# Altium project ESP32_WROOM_MOTOR_V11.PrjPCB
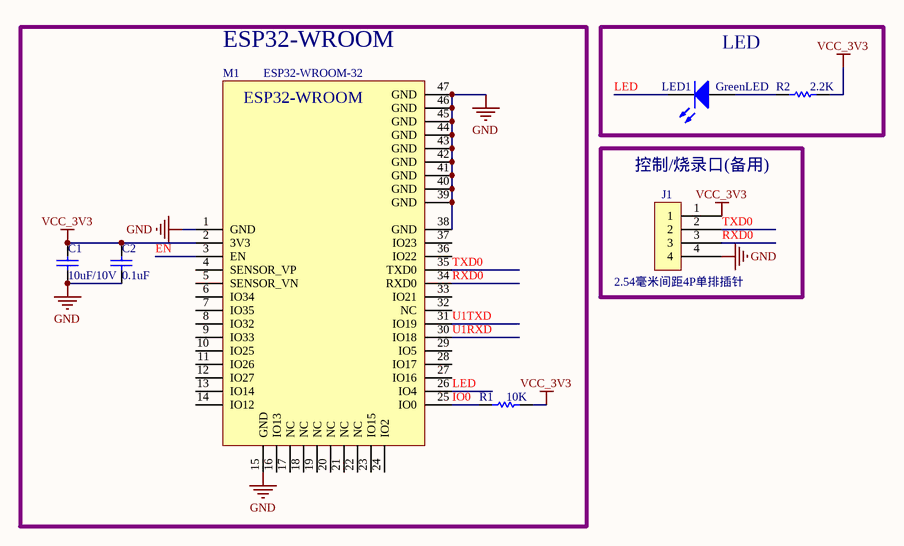
[diagram p0: 0.ESP32_WROOM.SchDoc]
5 sheets, 142 parts. Net scope: global (net labels, ports and power ports of the same name join across sheets).
Board file: ESP32_WROOM_MOTOR_V11.PcbDoc
Sheets:
  0.ESP32_WROOM.SchDoc
  1.USB-TO-UART.SchDoc
  2.POWER.SchDoc
  3.MOTOR.SchDoc
  4.POWER_48_TO_12.SchDoc

## Sheet 0.ESP32_WROOM.SchDoc
size A4; PageSetup: Record=PageOptions|CenterHorizontal=True|CenterVertical=True|PrintScale=0.50|XCorrection=1.00|YCorrection=1.00|PrintKind=1|BorderSize=5000000|LeftOffset=0|BottomOffset=0|Orientation=2|PaperLength=1000|PaperWidth=1000|Scale=100|PaperSource=7|PrintQuality=-4|MediaType=1|DitherType=10|PaperKind=A4|PrintScaleMode=1

### Parts
C1  10uF/10V  [0402]
C2  0.1uF  [0402]
J1  2.54毫米间距4P单排插针  [SIP4_2.54mm]
LED1  GreenLED  [LED0402]
M1  ESP32-WROOM-32  [ESP32_WROOM-32]
R1  10K  [0402]
R2  2.2K  [0402]

### Blocks framed on the sheet
ESP32-WROOM: C1 C2 M1 R1
LED: LED1 R2
控制/烧录口(备用): J1

### Nets
GND: C1.1 C2.1 J1.4 M1.1(GND) M1.15(GND) M1.38(GND) M1.39(GND) M1.40(GND) M1.41(GND) M1.42(GND) M1.43(GND) M1.44(GND) M1.45(GND) M1.46(GND) M1.47(GND)
VCC_3V3: C1.2 C2.2 J1.1 M1.2(3V3) R1.2 R2.2
EN: M1.3(EN)
IO0: M1.25(IO0) R1.1
LED: LED1.2(K) M1.26(IO4)
RXD0: J1.3 M1.34(RXD0)
TXD0: J1.2 M1.35(TXD0)
U1RXD: M1.30(IO18)
U1TXD: M1.31(IO19)
NetLED1_1: LED1.1(A) R2.1

Not connected (* = marked no-connect by the designer): M1 4(SENSOR_VP) 5(SENSOR_VN) 6(IO34) 7(IO35) 8(IO32) 9(IO33) 10(IO25) 11(IO26) 12(IO27) 13(IO14) 14(IO12) 16(IO13) 17(NC) 18(NC) 19(NC) 20(NC) 21(NC) 22(NC) 23(IO15) 24(IO2) 27(IO16) 28(IO17) 29(IO5) 32(NC) 33(IO21) 36(IO22) 37(IO23)

### Notes on the sheet
- (in symbol ESP32-WROOM-32) ESP32-WROOM

### Library data of the parts
C1 C2 = Cap: Capacitor; PartNumber: CAP100NF; Published: 8-Jun-2000; LatestRevisionDate: 17-Jul-2002; LatestRevisionNote: Re-released for DXP Platform.; PackageReference: 0402; Publisher: Altium Limited
  C1: Value: 10uF/10V
  C2: Value: 0.1uF
J1 = SIP4_MIRROR: Value: 2.54毫米间距4P单排插针
LED1 = LED2: Typical RED, GREEN, YELLOW, AMBER GaAs LED; Published: 8-Jun-2000; LatestRevisionDate: 17-Jul-2002; LatestRevisionNote: Re-released for DXP Platform.; PackageVersion: Feb-2002; PackageReference: 3.2X1.6X1.1; Publisher: Altium Limited; PackageDescription: SM LED; 2 Flat Leads; Value: GreenLED
R1 R2 = Res1: Resistor; PartNumber: RES2.2K; Published: 8-Jun-2000; LatestRevisionDate: 17-Jul-2002; LatestRevisionNote: Re-released for DXP Platform.; PackageReference: 0402; Publisher: Altium Limited
  R1: Value: 10K
  R2: Value: 2.2K

## Sheet 1.USB-TO-UART.SchDoc
size A4
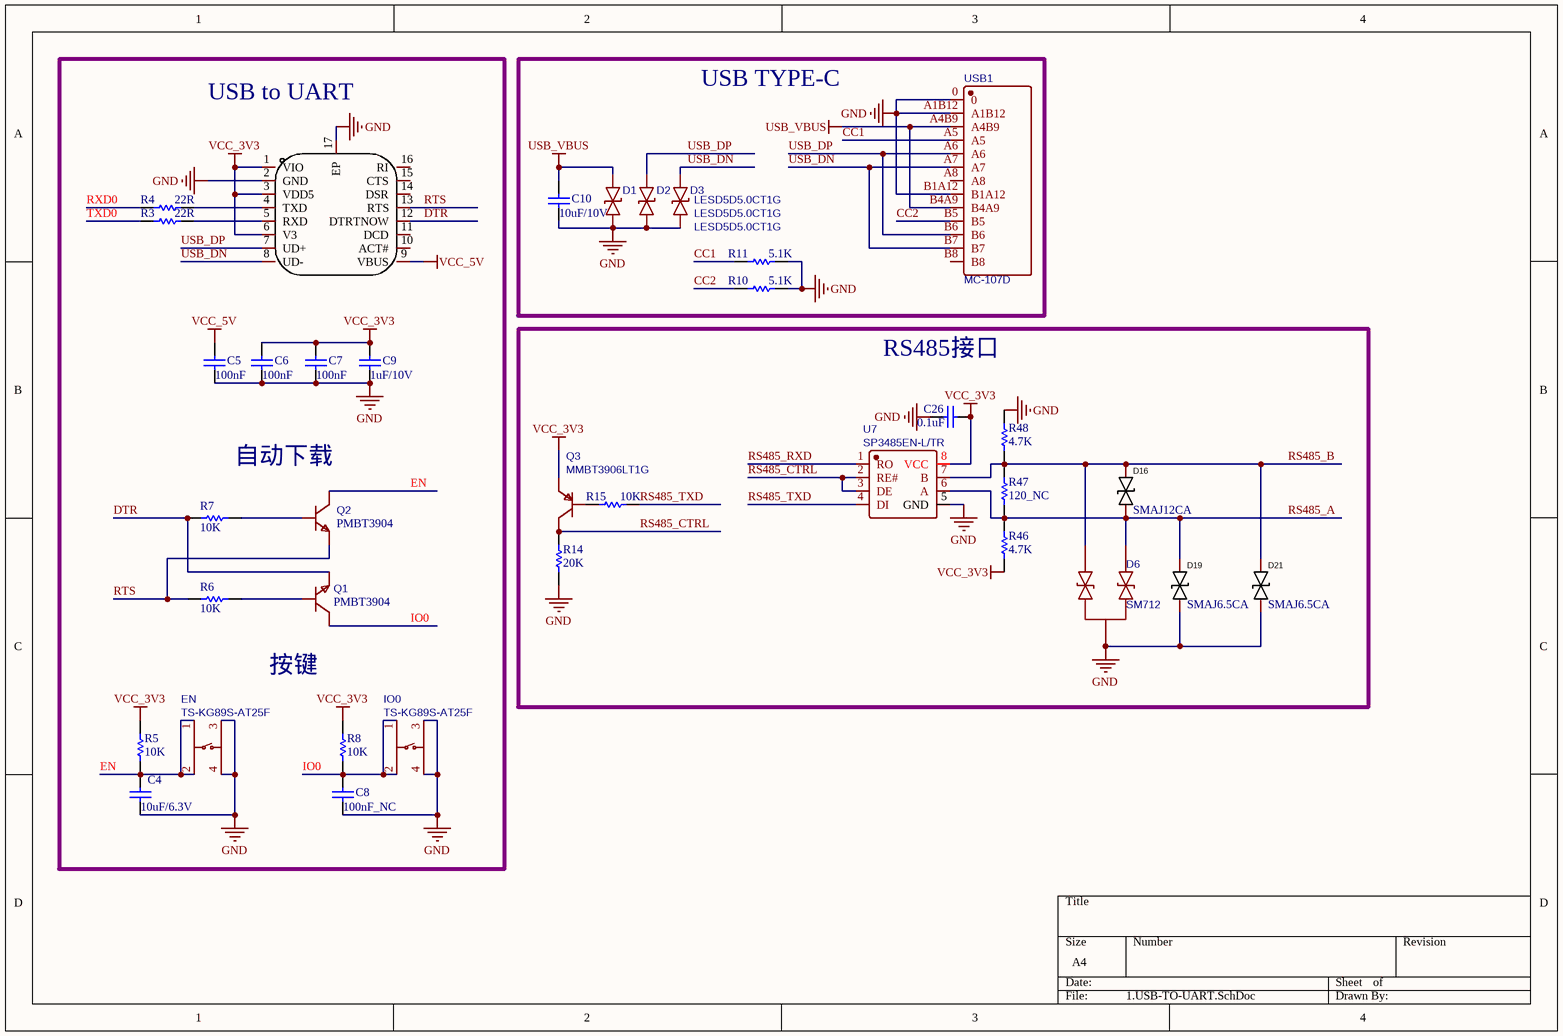
[diagram p1: 1.USB-TO-UART.SchDoc]

### Parts
C4  10uF/6.3V  [0402]
C5  100nF  [0402]
C6  100nF  [0402]
C7  100nF  [0402]
C8  100nF_NC  [0402]
C9  1uF/10V  [0402]
C10  10uF/10V  [0402]
C26  0.1uF  [0402]
D1  LESD5D5.0CT1G  [SOD-523_L1.2-W0.8-LS1.6-BI]
D2  LESD5D5.0CT1G  [SOD-523_L1.2-W0.8-LS1.6-BI]
D3  LESD5D5.0CT1G  [SOD-523_L1.2-W0.8-LS1.6-BI]
D6  SM712  [SOT-23-3_L2.9-W1.3-P1.90-LS2.4-BR]
D16  SMAJ12CA  [SMA_L4.3-W2.6-LS5.0-BI]
D19  SMAJ6.5CA  [SMA_L4.3-W2.6-LS5.0-BI]
D21  SMAJ6.5CA  [SMA_L4.3-W2.6-LS5.0-BI]
EN  TS-KG89S-AT25F  [SW-SMD_4P-L4.2-W3.3-P2.15-LS5.1]
IO0  TS-KG89S-AT25F  [SW-SMD_4P-L4.2-W3.3-P2.15-LS5.1]
Q1  PMBT3904  [SOT23]
Q2  PMBT3904  [SOT23]
Q3  MMBT3906LT1G  [SOT-23-3_L2.9-W1.3-P1.90-LS2.4-BR]
R3  22R  [0402]
R4  22R  [0402]
R5  10K  [0402]
R6  10K  [0402]
R7  10K  [0402]
R8  10K  [0402]
R10  5.1K  [0402]
R11  5.1K  [0402]
R14  20K  [0402]
R15  10K  [0402]
R46  4.7K  [0603]
R47  120_NC  [0603]
R48  4.7K  [0603]
U2  CH343P  [TQFN-16_L3.0-W3.0-P0.50-BL-EP1.7]  (value not drawn)
U7  SP3485EN-L/TR  [SOIC8]
USB1  MC-107D  [USB-C-SMD_MC-107D]

### Blocks framed on the sheet
USB TYPE-C: C10 D1-D3 R10 R11 USB1
RS485接口: C26 D6 D16 D19 D21 Q3 R14 R15 R46-R48 U7

### Nets
GND: C4.2 C5.1 C6.1 C7.1 C8.1 C9.1 C10.1 C26.1 D1.1 D2.1 D3.1 D6.3 D19.1 D21.1 EN.3 EN.4 IO0.3 IO0.4 R10.1 R11.1 R14.2 R48.2 U2.2(GND) U2.17(EP) U7.5(GND) USB1.0 USB1.A1B12 USB1.B1A12
USB_VBUS: C10.2 D1.2 USB1.A4B9 USB1.B4A9
VCC_3V3: C6.2 C7.2 C9.2 C26.2 Q3.2(E) R5.2 R8.2 R46.1 U2.1(VIO) U2.3(VDD5) U2.6(V3) U7.8(VCC)
VCC_5V: C5.2 U2.9(VBUS)
CC1: R11.2 USB1.A5
CC2: R10.2 USB1.B5
DTR: Q1.2(E) R7.1 U2.12(DTRTNOW)
EN: C4.1 EN.1 EN.2 Q2.3(C) R5.1
IO0: C8.2 IO0.1 IO0.2 Q1.3(C) R8.1
RS485_A: D6.1 D16.1 D19.2 R46.2 R47.1 U7.6(A)
RS485_B: D6.2 D16.2 D21.2 R47.2 R48.1 U7.7(B)
RS485_CTRL: Q3.3(C) R14.1 U7.2(RE#) U7.3(DE)
RS485_RXD: U7.1(RO)
RS485_TXD: R15.1 U7.4(DI)
RTS: Q2.2(E) R6.1 U2.13(RTS)
RXD0: R4.2
TXD0: R3.2
USB_DN: D3.2 U2.8(UD-) USB1.A7 USB1.B7
USB_DP: D2.2 U2.7(UD+) USB1.A6 USB1.B6
NetQ1_1: Q1.1(B) R6.2
NetQ2_1: Q2.1(B) R7.2
NetQ3_1: Q3.1(B) R15.2
NetR3_1: R3.1 U2.5(RXD)
NetR4_1: R4.1 U2.4(TXD)

Not connected (* = marked no-connect by the designer): U2 10(ACT#) 11(DCD) 14(DSR) 15(CTS) 16(RI); USB1 A8 B8

### Notes on the sheet
- (near U2) USB to UART
- 自动下载
- 按键

### Library data of the parts
C4-C10 C26 = Cap: Capacitor; PartNumber: CAP100NF; Published: 8-Jun-2000; LatestRevisionDate: 17-Jul-2002; LatestRevisionNote: Re-released for DXP Platform.; PackageReference: 0402; Publisher: Altium Limited
  C4: Value: 10uF/6.3V
  C5-C7: Value: 100nF
  C8: Value: 100nF_NC
  C9: Value: 1uF/10V
  C10: Value: 10uF/10V
  C26: Value: 0.1uF
D1-D3 = LESD5D5.0CT1G: BOM_Manufacturer: Leshan Radio; Contributor: LCSC; BOM_Supplier: LCSC; BOM_Supplier Part: C383211; BOM_Manufacturer Part: LESD5D5.0CT1G; BOM_JLCPCB Part Class: Extended Part; spicePre: D; spiceSymbolName: LESD5D5.0CT1G
D6 = SM712_C521963: BOM_Manufacturer: TECH PUBLIC; Contributor: LCSC; BOM_Supplier: LCSC; BOM_Supplier Part: C7420375; BOM_Manufacturer Part: SM712; BOM_JLCPCB Part Class: Extended Part; spicePre: D; spiceSymbolName: SM712_C521963
D16 D19 D21 = SMAJ15CA_C223985: Add into BOM: yes; Reverse Stand-Off Voltage (Vrwm): 15V; Breakdown Voltage: 16.7V; Maximum Clamping Voltage: 24.4V; Name: =Manufacturer Part; Supplier Footprint: SMA(DO-214AC); JLCPCB Part Class: Extended Part; Datasheet: https://atta.szlcsc.com/upload/public/pdf/source/20180803/C223985_64CE82AFF6455DB84DF7C89EB213FBC9.pdf; Supplier: LCSC; Convert to PCB: yes
  D16: Supplier Part: C353487
  D19 D21: Supplier Part: C110041
EN IO0 = TS-KG89S-AT25F: Contributor: LCSC; BOM_Supplier: LCSC; BOM_Supplier Part: C2874599; BOM_Manufacturer Part: TS-KG89S-AT25F; BOM_JLCPCB Part Class: Extended Part; spicePre: S; spiceSymbolName: TS-KG89S-AT25F
Q1 Q2 = BC847_C475630: BOM_Manufacturer: Shikues; spicePre: Q; Value: PMBT3904
Q3 = S8550_C545533: Contributor: LCSC; BOM_Supplier: LCSC; BOM_Supplier Part: C53444; BOM_Manufacturer Part: MMBT3906LT1G; BOM_JLCPCB Part Class: Extended Part; spicePre: Q; spiceSymbolName: MMBT3906LT1G
R3 R4 R46-R48 = Res1: Resistor; PartNumber: RES22R; Published: 8-Jun-2000; LatestRevisionDate: 17-Jul-2002; LatestRevisionNote: Re-released for DXP Platform.; PackageReference: 0402; Publisher: Altium Limited
  R3 R4: Value: 22R
  R46 R48: Value: 4.7K
  R47: Value: 120_NC
R5-R8 R10 R11 R14 R15 = Res1: Resistor; PartNumber: RES2.2K; Published: 8-Jun-2000; LatestRevisionDate: 17-Jul-2002; LatestRevisionNote: Re-released for DXP Platform.; PackageReference: 0402; Publisher: Altium Limited
  R5-R8 R15: Value: 10K
  R10 R11: Value: 5.1K
  R14: Value: 20K
U2 = CH343P: Add into BOM: yes; Name: CH343P; Symbol: CH343P; Device: CH343P; LCSC Part Name: CH343P; Supplier Part: C2846043; Manufacturer Part: CH343P; Supplier Footprint: QFN-16; JLCPCB Part Class: Extended Part; Datasheet: https://atta.szlcsc.com/upload/public/pdf/source/20211010/C2846043_7FA705E1F14A2906F6A2AFA45FA28209.pdf; Supplier: LCSC; Convert to PCB: yes; Type: -; Protocol: -; Number of Drivers/Receivers: -; Data Rate: -; Supply Voltage: -
U7 = SP3485EN-L/TR: BOM_Manufacturer: EXAR; SMT Type: Basic; BOM_Supplier: LCSC; BOM_Manufacturer Part: SP3485EN-L/TR; BOM_LCSC Assembly: Yes; image: //image.lceda.cn/szlcsc/C8963.jpg; BOM_Supplier Part: C8963; spicePre: U; spiceSymbolName: SP3485EN-L/TR
USB1 = MC-107D: Contributor: LCSC; BOM_Supplier: LCSC; BOM_Supplier Part: C2874568; BOM_Manufacturer Part: MC-107D; BOM_JLCPCB Part Class: Extended Part; spicePre: U; spiceSymbolName: MC-107D

## Sheet 2.POWER.SchDoc
size A4
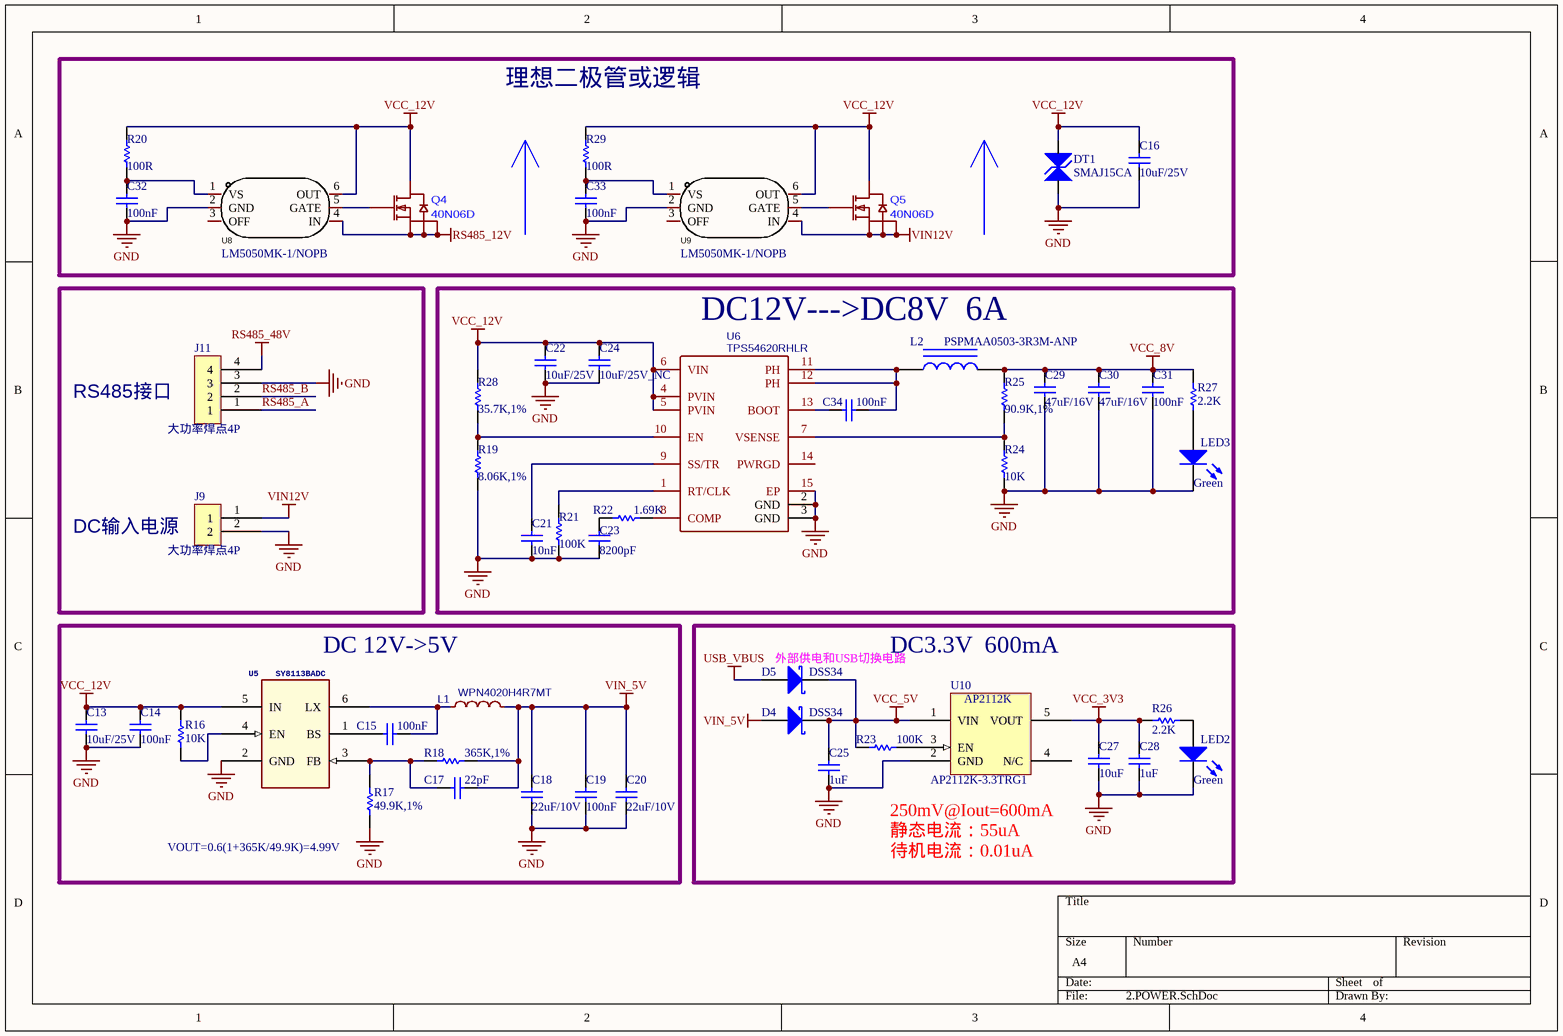
[diagram p2: 2.POWER.SchDoc]

### Parts
C13  10uF/25V  [0805C]
C14  100nF  [0402]
C15  100nF  [0402]
C16  10uF/25V  [0805C]
C17  22pF  [0402]
C18  22uF/10V  [0603]
C19  100nF  [0402]
C20  22uF/10V  [0603]
C21  10nF  [0402]
C22  10uF/25V  [0805C]
C23  8200pF  [0402]
C24  10uF/25V_NC  [0805C]
C25  1uF  [0402]
C27  10uF  [0402]
C28  1uF  [0402]
C29  47uF/16V  [1206C]
C30  47uF/16V  [1206C]
C31  100nF  [0402]
C32  100nF  [0402]
C33  100nF  [0402]
C34  100nF  [0402]
D4  DSS34  [SOD-123_L2.8-W1.8-LS3.7-RD]
D5  DSS34  [SOD-123_L2.8-W1.8-LS3.7-RD]
DT1  SMAJ15CA  [SMA_L4.3-W2.6-LS5.0-BI]
J9  大功率焊点4P  [CONN-TH_P3.5-2P]
J11  大功率焊点4P  [CONN-TH_P3.5_4P]
L1  WPN4020H4R7MT  [IND-SMD_L4.0-W4.0]
L2  PSPMAA0503-3R3M-ANP  [IND-SMD_L5.4-W5.2_PSPMAA0503]
LED2  Green  [LED0402]
LED3  Green  [LED0402]
Q4  40N06D  [WDFN-5_L3.3-W3.3-P0.65-BL]
Q5  40N06D  [WDFN-5_L3.3-W3.3-P0.65-BL]
R16  10K  [0402]
R17  49.9K,1%  [0402]
R18  365K,1%  [0402]
R19  8.06K,1%  [0402]
R20  100R  [0402]
R21  100K  [0402]
R22  1.69K  [0402]
R23  100K  [0402]
R24  10K  [0402]
R25  90.9K,1%  [0402]
R26  2.2K  [0402]
R27  2.2K  [0402]
R28  35.7K,1%  [0402]
R29  100R  [0402]
U5  SY8113BADC  [SOT23-6]
U6  TPS54620RHLR  [VQFN-14_L3.5-W3.5-P0.50-TL-EP_TPS54622RHLT]
U8  LM5050MK-1/NOPB  [TSOT-23-6_L2.9-W1.6-P0.95-LS2.8-BR]
U9  LM5050MK-1/NOPB  [TSOT-23-6_L2.9-W1.6-P0.95-LS2.8-BR]
U10  AP2112K-3.3TRG1  [SOT23-5]

### Blocks framed on the sheet
理想二极管或逻辑: C16 C32 C33 DT1 Q4 Q5 R20 R29 U8 U9
DC12V--->DC8V  6A: C21-C24 C29-C31 C34 L2 LED3 R19 R21 R22 R24 R25 R27 R28 U6
DC 12V->5V: C13-C15 C17-C20 L1 R16-R18 U5
DC3.3V  600mA: C25 C27 C28 D4 D5 LED2 R23 R26 U10

### Nets
GND: C13.2 C14.1 C16.2 C18.2 C19.2 C20.2 C21.1 C22.2 C23.1 C24.2 C25.2 C27.1 C28.1 C29.2 C30.2 C31.1 C32.1 C33.1 DT1.1 J9.2 J11.3 LED2.2(K) LED3.2(K) R17.2 R19.2 R21.2 R24.2 U5.2(GND) U6.2(GND) U6.3(GND) U6.15(EP) U8.2(GND) U9.2(GND) U10.2(GND)
RS485_12V: Q4.1(S) Q4.2(S) Q4.3(S) U8.4(IN)
RS485_48V: J11.4
USB_VBUS: D5.1(A)
VCC_3V3: C27.2 C28.2 R26.2 U10.5(VOUT)
VCC_5V: C25.1 D4.2(K) D5.2(K) R23.1 U10.1(VIN)
VCC_8V: C29.1 C30.1 C31.2 L2.2 R25.1 R27.2
VCC_12V: C13.1 C14.2 C16.1 C22.1 C24.1 DT1.2 Q4.5(D) Q5.5(D) R16.2 R20.1 R28.1 R29.1 U5.5(IN) U6.4(PVIN) U6.5(PVIN) U6.6(VIN) U8.6(OUT) U9.6(OUT)
VIN12V: J9.1 Q5.1(S) Q5.2(S) Q5.3(S) U9.4(IN)
VIN_5V: C17.1 C18.1 C19.1 C20.1 D4.1(A) L1.2 R18.1
RS485_A: J11.1
RS485_B: J11.2
NetC15_1: C15.1 L1.1 U5.6(LX)
NetC15_2: C15.2 U5.1(BS)
NetC17_2: C17.2 R17.1 R18.2 U5.3(FB)
NetC21_2: C21.2 U6.9(SS/TR)
NetC23_2: C23.2 R22.1
NetC32_2: C32.2 R20.2 U8.1(VS)
NetC33_2: C33.2 R29.2 U9.1(VS)
NetC34_1: C34.1 U6.13(BOOT)
NetC34_2: C34.2 L2.1 U6.11(PH) U6.12(PH)
NetLED2_1: LED2.1(A) R26.1
NetLED3_1: LED3.1(A) R27.1
NetQ4_4: Q4.4(G) U8.5(GATE)
NetQ5_4: Q5.4(G) U9.5(GATE)
NetR16_1: R16.1 U5.4(EN)
NetR19_1: R19.1 R28.2 U6.10(EN)
NetR21_1: R21.1 U6.1(RT/CLK)
NetR22_2: R22.2 U6.8(COMP)
NetR23_2: R23.2 U10.3(EN)
NetR24_1: R24.1 R25.2 U6.7(VSENSE)

Not connected (* = marked no-connect by the designer): U6 14(PWRGD); U8 3(OFF); U9 3(OFF); U10 4(N/C)

### Notes on the sheet
- RS485接口
- DC输入电源
- (near D5) 外部供电和USB切换电路
- (near R17) VOUT=0.6(1+365K/49.9K)=4.99V
- 250mV@Iout=600mA
- 静态电流：55uA
- 待机电流：0.01uA
- (in symbol AP2112) AP2112K

### Library data of the parts
C13-C25 C27-C34 = Cap: Capacitor; PartNumber: CAP100NF; Published: 8-Jun-2000; LatestRevisionDate: 17-Jul-2002; LatestRevisionNote: Re-released for DXP Platform.; PackageReference: 0402; Publisher: Altium Limited
  C13 C16 C22: Value: 10uF/25V
  C14 C15 C19 C31-C34: Value: 100nF
  C17: Value: 22pF
  C18 C20: Value: 22uF/10V
  C21: Value: 10nF
  C23: Value: 8200pF
  C24: Value: 10uF/25V_NC
  C25 C28: Value: 1uF
  C27: Value: 10uF
  C29 C30: Value: 47uF/16V
D4 D5 = D Schottky: Schottky Diode; Published: 8-Jun-2000; LatestRevisionDate: 17-Jul-2002; LatestRevisionNote: Re-released for DXP Platform.; PackageReference: SMB; Publisher: Altium Limited; PackageDescription: DO-214-AA/SMB; 2 C-Bend Leads; Body 5.3 x 3.6 mm, inc. leads (LxW); Code_JEDEC: DO-214-AA; Value: DSS34
DT1 = 1110503009: 存货名称: TVS管; Value: SMAJ15CA
J9 = SIP2
J11 = SIP4
L1 = 2.2uH: BOM_Manufacturer: Sunlord; nameAlias: Inductance; BOM_Supplier: LCSC; BOM_Supplier Part: C98363; BOM_JLCPCB Part Class: Extended Part; spicePre: L
L2 = 0603 3.9nH 0.3nH: 贴片电感; ComponentLink1Description: 供应商链接; ComponentLink1URL: http://www.szlcsc.com/product/details_14473.html; Supplier: LC; SuppliersPartNumber: C436534; Value: PSPMAA0503-3R3M-ANP
LED2 LED3 = LED2: as LED1 on sheet 0.ESP32_WROOM; Published: 8-Jun-2000; LatestRevisionDate: 17-Jul-2002; LatestRevisionNote: Re-released for DXP Platform.; PackageVersion: Feb-2002; PackageReference: 3.2X1.6X1.1; Publisher: Altium Limited; PackageDescription: SM LED; 2 Flat Leads; Value: Green
R16-R18 R26 = Res1: Resistor; PartNumber: RES2.2K; Published: 8-Jun-2000; LatestRevisionDate: 17-Jul-2002; LatestRevisionNote: Re-released for DXP Platform.; PackageReference: 0402; Publisher: Altium Limited
  R16: Value: 10K
  R17: Value: 49.9K,1%
  R18: Value: 365K,1%
  R26: Value: 2.2K
R19-R25 R28 R29 = Res1: Resistor; PartNumber: RES22R; Published: 8-Jun-2000; LatestRevisionDate: 17-Jul-2002; LatestRevisionNote: Re-released for DXP Platform.; PackageReference: 0402; Publisher: Altium Limited
  R19: Value: 8.06K,1%
  R20 R29: Value: 100R
  R21 R23: Value: 100K
  R22: Value: 1.69K
  R24: Value: 10K
  R25: Value: 90.9K,1%
  R28: Value: 35.7K,1%
R27 = Res1: Resistor; PartNumber: RES22.1K; Published: 8-Jun-2000; LatestRevisionDate: 17-Jul-2002; LatestRevisionNote: Re-released for DXP Platform.; PackageReference: 0402; Publisher: Altium Limited; Value: 2.2K
U5 = SY81XX: Part Type: IC DC-DC
U6 = TPS54620RHLR: BOM_Manufacturer: Texas Instruments; Contributor: LCSC; BOM_Supplier: LCSC; BOM_Supplier Part: C263274; BOM_Manufacturer Part: TPS54620RHLR; BOM_JLCPCB Part Class: Extended Part; spicePre: U; spiceSymbolName: TPS54620RHLR
U8 U9 = LM5050MK-1/NOPB: Designer: U?; Symbol: LM5050MK-1/NOPB; Device: LM5050MK-1/NOPB; JLC NO: C129323
U10 = AP2112: Value: AP2112K-3.3TRG1
Q4 Q5 = 40N06D: JLC NO: C7543836

## Sheet 3.MOTOR.SchDoc
size A4
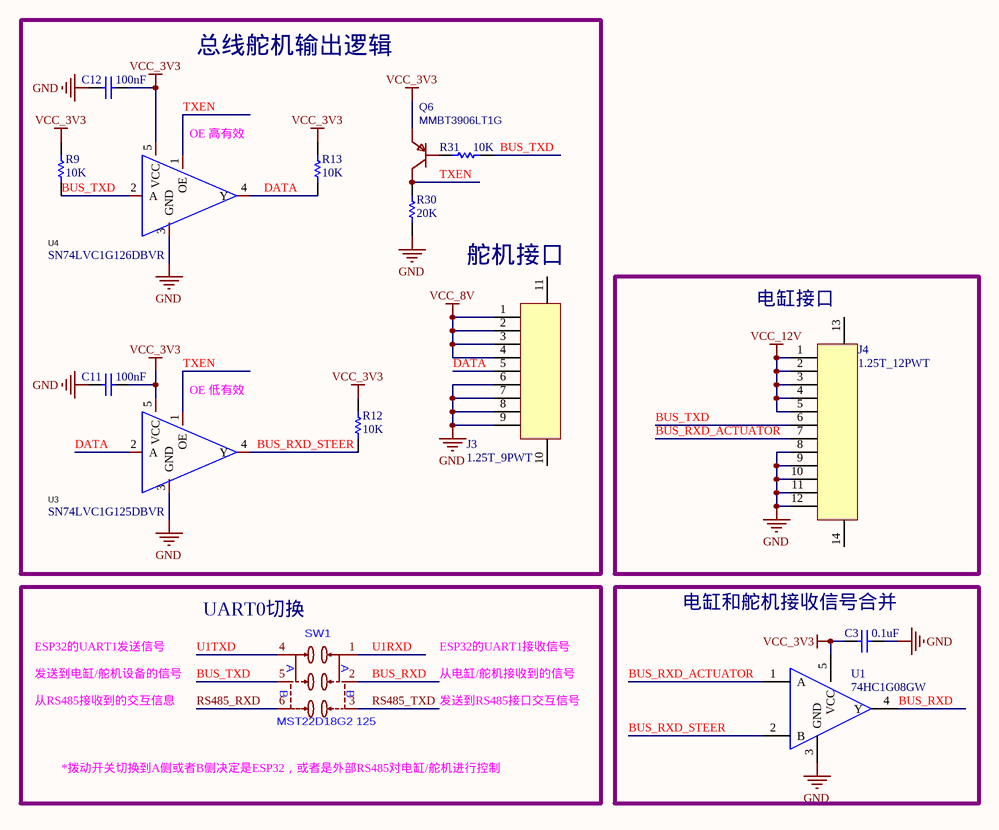
[diagram p3: 3.MOTOR.SchDoc]

### Parts
C3  0.1uF  [0402]
C11  100nF  [0402]
C12  100nF  [0402]
J3  1.25T_9PWT  [CONN-SMD_9P-P1.25_SHOU-HAN_1.25-9P-WT]
J4  1.25T_12PWT  [CONN-SMD_12P-P1.25_HCTL_HC-1.25-12PWT]
Q6  MMBT3906LT1G  [SOT-23-3_L2.9-W1.3-P1.90-LS2.4-BR]
R9  10K  [0402]
R12  10K  [0402]
R13  10K  [0402]
R30  20K  [0402]
R31  10K  [0402]
SW1  MST22D18G2 125  [SW-SMD_MST22D18G2]
U1  74HC1G08GW  [SOT-353_L2.1-W1.3-P0.65-LS2.3-BR]
U3  SN74LVC1G125DBVR  [SOT23-5]
U4  SN74LVC1G126DBVR  [SOT23-5]

### Blocks framed on the sheet
电缸接口: J4
UART0切换: SW1
电缸和舵机接收信号合并: C3 U1

### Nets
GND: C3.1 C11.2 C12.2 J3.6 J3.7 J3.8 J3.9 J4.8 J4.9 J4.10 J4.11 J4.12 R30.2 U1.3(GND) U3.3(GND) U4.3(GND)
VCC_3V3: C3.2 C11.1 C12.1 Q6.2(E) R9.2 R12.2 R13.2 U1.5(VCC) U3.5(VCC) U4.5(VCC)
VCC_8V: J3.1 J3.2 J3.3 J3.4
VCC_12V: J4.1 J4.2 J4.3 J4.4 J4.5
BUS_RXD: SW1.2 U1.4(Y)
BUS_RXD_ACTUATOR: J4.7 U1.1(A)
BUS_RXD_STEER: R12.1 U1.2(B) U3.4(Y)
BUS_TXD: J4.6 R9.1 R31.1 SW1.5 U4.2(A)
DATA: J3.5 R13.1 U3.2(A) U4.4(Y)
RS485_RXD: SW1.6
RS485_TXD: SW1.3
TXEN: Q6.3(C) R30.1 U3.1(OE) U4.1(OE)
U1RXD: SW1.1
U1TXD: SW1.4
NetQ6_1: Q6.1(B) R31.2

Not connected (* = marked no-connect by the designer): J3 10 11; J4 13 14

### Notes on the sheet
- 总线舵机输出逻辑
- (near U4) OE 高有效
- (near J3) 舵机接口
- (near U3) OE 低有效
- ESP32的UART1发送信号
- ESP32的UART1接收信号
- 从RS485接收到的交互信息
- 发送到电缸/舵机设备的信号
- 从电缸/舵机接收到的信号
- 发送到RS485接口交互信号
- *拨动开关切换到A侧或者B侧决定是ESP32，或者是外部RS485对电缸/舵机进行控制
- (in symbol MST22D18G2 125) A; B

### Library data of the parts
C3 C11 C12 = Cap: Capacitor; PartNumber: CAP100NF; Published: 8-Jun-2000; LatestRevisionDate: 17-Jul-2002; LatestRevisionNote: Re-released for DXP Platform.; PackageReference: 0402; Publisher: Altium Limited
  C3: Value: 0.1uF
  C11 C12: Value: 100nF
J3 = 1.25T_9P: JLC NO: C5340796
J4 = 1.25T_12P: JLC NO: C2937184
Q6 = S8550_C545533: Contributor: LCSC; BOM_Supplier: LCSC; BOM_Supplier Part: C53444; BOM_Manufacturer Part: MMBT3906LT1G; BOM_JLCPCB Part Class: Extended Part; spicePre: Q; spiceSymbolName: MMBT3906LT1G
R9 R12 R13 R30 R31 = Res1: Resistor; PartNumber: RES2.2K; Published: 8-Jun-2000; LatestRevisionDate: 17-Jul-2002; LatestRevisionNote: Re-released for DXP Platform.; PackageReference: 0402; Publisher: Altium Limited
  R9 R12 R13 R31: Value: 10K
  R30: Value: 20K
U1 = 74HC1G08: JLC NO: C12500
U3 U4 = 74LVC1G126GW,125: Add into BOM: yes; Supplier Footprint: SOT-23-5; JLCPCB Part Class: Extended Part; Supplier: LCSC; Convert to PCB: yes
  U3: Name: SN74LVC1G125DBVR; Symbol: SN74LVC1G125DBVR; Device: SN74LVC1G125DBVR; LCSC Part Name: SN74LVC1G125DBVR; JLC NO: C23654; Manufacturer Part: SN74LVC1G125DBVR
  U4: Name: SN74LVC1G126DBVR; Symbol: SN74LVC1G126DBVR; Device: SN74LVC1G126DBVR; LCSC Part Name: SN74LVC1G126DBVR; JLC NO: C7834; Manufacturer Part: SN74LVC1G126DBVR
SW1 = MST22D18G2 125: JLC NO: C2906280

## Sheet 4.POWER_48_TO_12.SchDoc
size A4
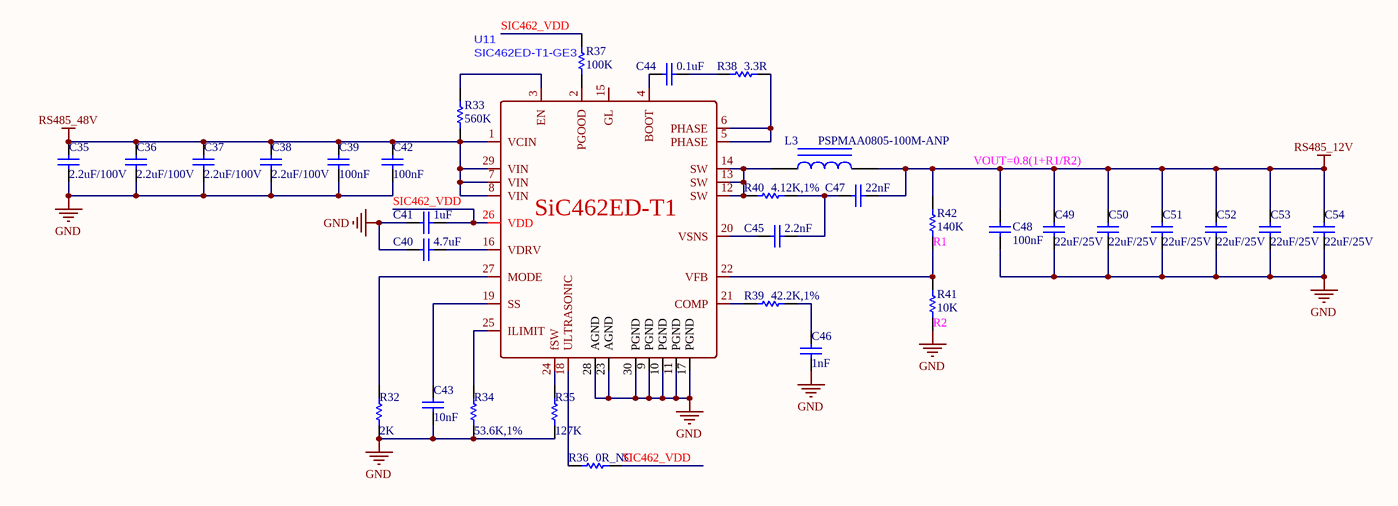
[diagram p4: 4.POWER_48_TO_12.SchDoc]

### Parts
C35  2.2uF/100V  [1206C]
C36  2.2uF/100V  [1206C]
C37  2.2uF/100V  [1206C]
C38  2.2uF/100V  [1206C]
C39  100nF  [0402]
C40  4.7uF  [0402]
C41  1uF  [0402]
C42  100nF  [0402]
C43  10nF  [0402]
C44  0.1uF  [0402]
C45  2.2nF  [0402]
C46  1nF  [0402]
C47  22nF  [0402]
C48  100nF  [0402]
C49  22uF/25V  [0805C]
C50  22uF/25V  [0805C]
C51  22uF/25V  [0805C]
C52  22uF/25V  [0805C]
C53  22uF/25V  [0805C]
C54  22uF/25V  [0805C]
L3  PSPMAA0805-100M-ANP  [IND-SMD_L8.5-W8.0_PCC-M0854M]
R32  2K  [0402]
R33  560K  [0402]
R34  53.6K,1%  [0402]
R35  127K  [0402]
R36  0R_NC  [0402]
R37  100K  [0402]
R38  3.3R  [0402]
R39  42.2K,1%  [0402]
R40  4.12K,1%  [0402]
R41  10K  [0402]
R42  140K  [0402]
U11  SIC462ED-T1-GE3  [MLP55-27_L5.0-W5.0-P0.50-TL_SIC46XXX]

### Nets
GND: C35.2 C36.2 C37.2 C38.2 C39.2 C40.2 C41.2 C42.2 C43.1 C46.1 C48.2 C49.2 C50.2 C51.2 C52.2 C53.2 C54.2 R32.2 R34.2 R35.2 R41.1 U11.9(PGND) U11.10(PGND) U11.11(PGND) U11.17(PGND) U11.23(AGND) U11.28(AGND) U11.30(PGND)
RS485_12V: C47.2 C48.1 C49.1 C50.1 C51.1 C52.1 C53.1 C54.1 L3.2 R42.2
RS485_48V: C35.1 C36.1 C37.1 C38.1 C39.1 C42.1 R33.1 U11.1(VCIN) U11.7(VIN) U11.8(VIN) U11.29(VIN)
SIC462_VDD: C41.1 R36.1 R37.2 U11.26(VDD)
NetC40_1: C40.1 U11.16(VDRV)
NetC43_2: C43.2 U11.19(SS)
NetC44_1: C44.1 R38.1
NetC44_2: C44.2 U11.4(BOOT)
NetC45_1: C45.1 C47.1 R40.2
NetC45_2: C45.2 U11.20(VSNS)
NetC46_2: C46.2 R39.2
NetL3_1: L3.1 R40.1 U11.12(SW) U11.13(SW) U11.14(SW)
NetR32_1: R32.1 U11.27(MODE)
NetR33_2: R33.2 U11.3(EN)
NetR34_1: R34.1 U11.25(ILIMIT)
NetR35_1: R35.1 U11.24(fSW)
NetR36_2: R36.2 U11.18(ULTRASONIC)
NetR37_1: R37.1 U11.2(PGOOD)
NetR38_2: R38.2 U11.5(PHASE) U11.6(PHASE)
NetR39_1: R39.1 U11.21(COMP)
NetR41_2: R41.2 R42.1 U11.22(VFB)

Not connected (* = marked no-connect by the designer): U11 15(GL)

### Notes on the sheet
- VOUT=0.8(1+R1/R2)
- (near R42) R1
- (near R41) R2
- (in symbol SIC462ED-T1-GE3) SiC462ED-T1

### Library data of the parts
C35-C54 = Cap: Capacitor; PartNumber: CAP100NF; Published: 8-Jun-2000; LatestRevisionDate: 17-Jul-2002; LatestRevisionNote: Re-released for DXP Platform.; PackageReference: 0402; Publisher: Altium Limited
  C35-C38: Value: 2.2uF/100V
  C39 C42 C48: Value: 100nF
  C40: Value: 4.7uF
  C41: Value: 1uF
  C43: Value: 10nF
  C44: Value: 0.1uF
  C45: Value: 2.2nF
  C46: Value: 1nF
  C47: Value: 22nF
  C49-C54: Value: 22uF/25V
L3 = 0603 3.9nH 0.3nH: 贴片电感; ComponentLink1Description: 供应商链接; Supplier: LC; JLC NO: C2962885; Value: PSPMAA0805-100M-ANP
R32-R42 = Res1: Resistor; PartNumber: RES22R; Published: 8-Jun-2000; LatestRevisionDate: 17-Jul-2002; LatestRevisionNote: Re-released for DXP Platform.; PackageReference: 0402; Publisher: Altium Limited
  R32: Value: 2K
  R33: Value: 560K
  R34: Value: 53.6K,1%
  R35: Value: 127K
  R36: Value: 0R_NC
  R37: Value: 100K
  R38: Value: 3.3R
  R39: Value: 42.2K,1%
  R40: Value: 4.12K,1%
  R41: Value: 10K
  R42: Value: 140K
U11 = SIC462ED-T1-GE3: JLC NO: C335617

## Nets that join several sheets
GND: 0.ESP32_WROOM (15 pins), 1.USB-TO-UART (28 pins), 2.POWER (34 pins), 3.MOTOR (16 pins), 4.POWER_48_TO_12 (28 pins)
RS485_12V: 2.POWER (Q4.1 Q4.2 Q4.3 U8.4), 4.POWER_48_TO_12 (10 pins)
RS485_48V: 2.POWER (J11.4), 4.POWER_48_TO_12 (11 pins)
USB_VBUS: 1.USB-TO-UART (C10.2 D1.2 USB1.A4B9 USB1.B4A9), 2.POWER (D5.1)
VCC_3V3: 0.ESP32_WROOM (6 pins), 1.USB-TO-UART (12 pins), 2.POWER (C27.2 C28.2 R26.2 U10.5), 3.MOTOR (10 pins)
VCC_5V: 1.USB-TO-UART (C5.2 U2.9), 2.POWER (5 pins)
VCC_8V: 2.POWER (6 pins), 3.MOTOR (J3.1 J3.2 J3.3 J3.4)
VCC_12V: 2.POWER (18 pins), 3.MOTOR (5 pins)
EN: 0.ESP32_WROOM (M1.3), 1.USB-TO-UART (5 pins)
IO0: 0.ESP32_WROOM (M1.25 R1.1), 1.USB-TO-UART (5 pins)
RS485_A: 1.USB-TO-UART (6 pins), 2.POWER (J11.1)
RS485_B: 1.USB-TO-UART (6 pins), 2.POWER (J11.2)
RS485_RXD: 1.USB-TO-UART (U7.1), 3.MOTOR (SW1.6)
RS485_TXD: 1.USB-TO-UART (R15.1 U7.4), 3.MOTOR (SW1.3)
RXD0: 0.ESP32_WROOM (J1.3 M1.34), 1.USB-TO-UART (R4.2)
TXD0: 0.ESP32_WROOM (J1.2 M1.35), 1.USB-TO-UART (R3.2)
U1RXD: 0.ESP32_WROOM (M1.30), 3.MOTOR (SW1.1)
U1TXD: 0.ESP32_WROOM (M1.31), 3.MOTOR (SW1.4)